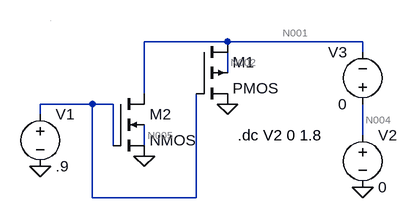
[diagram p0: schematic tut2 Q7.asc]
tut2 Q7.asc, the LTspice schematic file:
Version 4
SHEET 1 880 680
WIRE 272 32 144 32
WIRE 480 32 272 32
WIRE 480 48 480 32
WIRE 272 80 272 48
WIRE 144 112 144 32
WIRE 64 128 -16 128
WIRE 96 128 64 128
WIRE -16 144 -16 128
WIRE 480 176 480 128
WIRE 96 192 96 128
WIRE 144 192 144 160
WIRE 64 272 64 128
WIRE 224 272 224 112
WIRE 224 272 64 272
WIRE 0 0 0 0
FLAG 272 128 0
FLAG -16 224 0
FLAG 144 208 0
FLAG 480 256 0
SYMBOL voltage -16 128 R0
WINDOW 123 0 0 Left 2
WINDOW 39 0 0 Left 2
SYMATTR InstName V1
SYMATTR Value .9
SYMBOL pmos4 224 32 R0
SYMATTR InstName M1
SYMATTR Value2 l=.18 w=5
SYMBOL nmos4 96 112 R0
SYMATTR InstName M2
SYMATTR Value2 l=.18 w=5
SYMBOL voltage 480 160 R0
WINDOW 123 0 0 Left 2
WINDOW 39 0 0 Left 2
SYMATTR InstName V2
SYMATTR Value 0
SYMBOL voltage 480 144 R180
WINDOW 0 24 96 Left 2
WINDOW 3 24 16 Left 2
WINDOW 123 0 0 Left 2
WINDOW 39 0 0 Left 2
SYMATTR InstName V3
SYMATTR Value 0
TEXT 288 176 Left 2 !.dc V2 0 1.8

The netlist it stands for:
* tut2 Q7.asc
V1 N003 0 .9
M1 N001 N003 0 N002 PMOS l=.18 w=5
M2 N001 N003 0 N005 NMOS l=.18 w=5
V2 N004 0 0
V3 N004 N001 0
.model NMOS NMOS
.model PMOS PMOS
.lib standard.mos
.dc V2 0 1.8
.backanno
.end

* Results of the author's LTspice run, read from the files saved beside the schematic
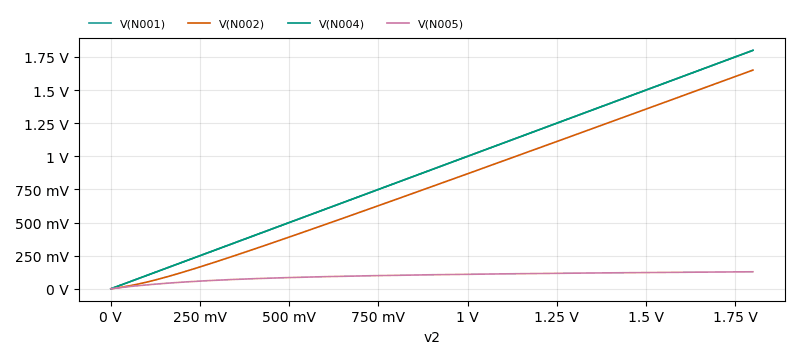
[diagram p1: DC transfer characteristic of tut2 Q7.asc, plotted from the saved traces]
* DC transfer characteristic, 1 run:
*   V(N001): 0 V at v2=0 V, 1.8 V at v2=1.8 V, min 0 V, max 1.8 V
*   V(N002): -0.1143 fV at v2=0 V, 1.651 V at v2=1.8 V, min -0.1143 fV, max 1.651 V
*   V(N004): 0 V at v2=0 V, 1.8 V at v2=1.8 V, min 0 V, max 1.8 V
*   V(N005): 5.584e-08 fV at v2=0 V, 128.4 mV at v2=1.8 V, min 5.584e-08 fV, max 128.4 mV